# Altium schematic sheet ESP8266.SchDoc
size B; SheetNumber: 1; SheetTotal: 1
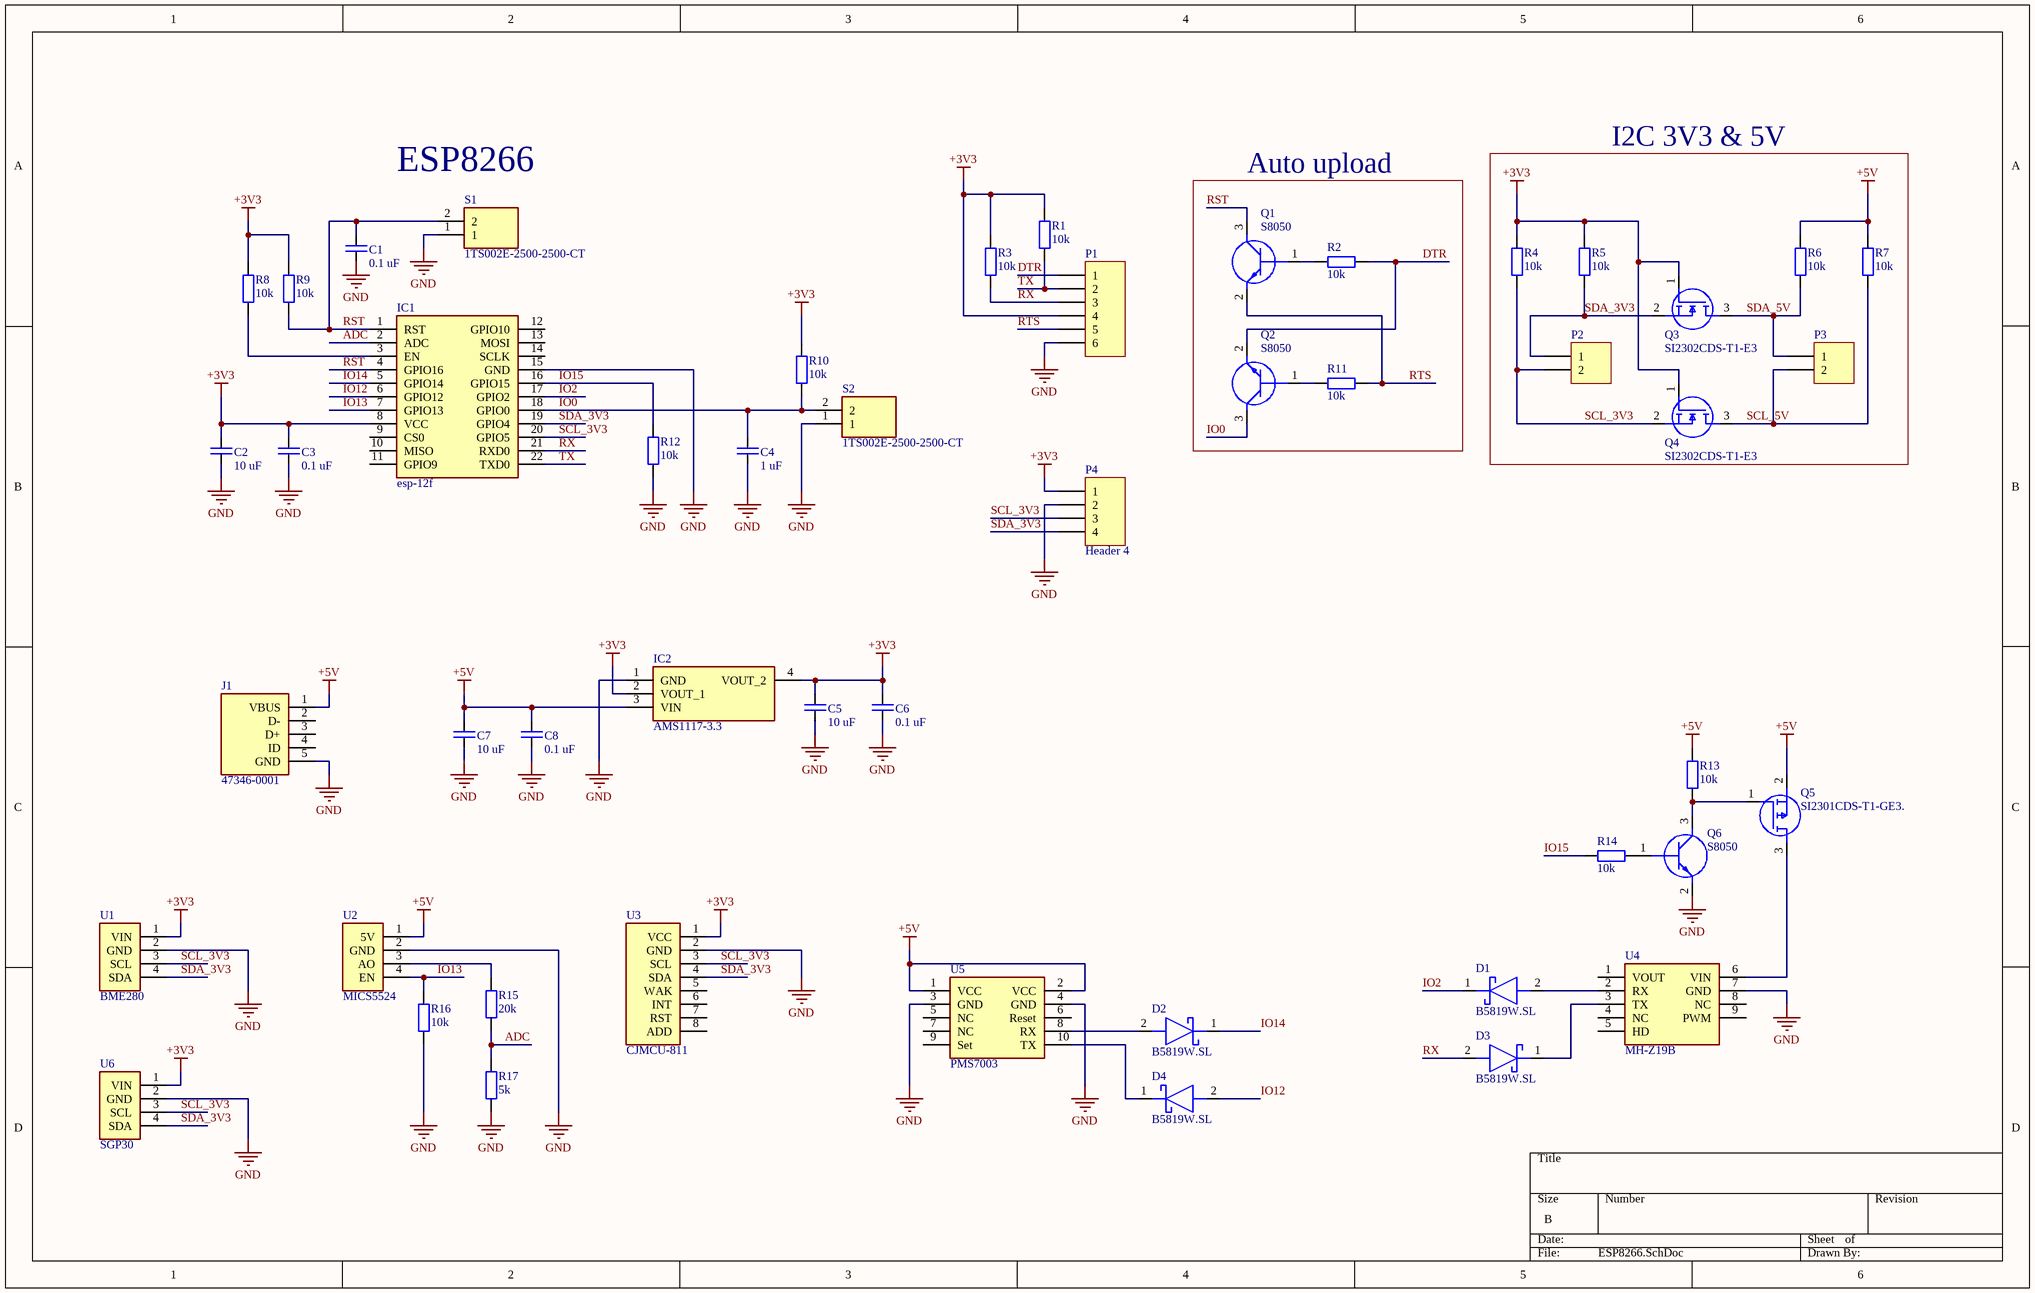
[diagram p0: ESP8266.SchDoc]

## Parts
C1  0.1 uF  [C2012_0805I_N]
C2  10 uF  [C2012_0805I_N]
C3  0.1 uF  [C2012_0805I_N]
C4  1 uF  [C2012_0805I_N]
C5  10 uF  [C2012_0805I_N]
C6  0.1 uF  [C2012_0805I_N]
C7  10 uF  [C2012_0805I_N]
C8  0.1 uF  [C2012_0805I_N]
D1  B5819W.SL  [B5819WSL]
D2  B5819W.SL  [B5819WSL]
D3  B5819W.SL  [B5819WSL]
D4  B5819W.SL  [B5819WSL]
IC1  esp-12f  [esp12f]
IC2  AMS1117-3.3  [SOT229P700X180-4N]
J1  47346-0001  [47346-0001]
P1  (no value)  [HDR1X6]
P2  (no value)  [HDR1X2]
P3  (no value)  [HDR1X2]
P4  Header 4  [HDR1X4]
Q1  S8050  [SOT95P240X110-3N]
Q2  S8050  [SOT95P240X110-3N]
Q3  SI2302CDS-T1-E3  [SOT95P237X112-3N]
Q4  SI2302CDS-T1-E3  [SOT95P237X112-3N]
Q5  SI2301CDS-T1-GE3.  [SOT95P237X112-3N]
Q6  S8050  [SOT95P240X110-3N]
R1  10k  [R2012_0805I_N]
R2  10k  [R2012_0805I_N]
R3  10k  [R2012_0805I_N]
R4  10k  [R2012_0805I_N]
R5  10k  [R2012_0805I_N]
R6  10k  [R2012_0805I_N]
R7  10k  [R2012_0805I_N]
R8  10k  [R2012_0805I_N]
R9  10k  [R2012_0805I_N]
R10  10k  [R2012_0805I_N]
R11  10k  [R2012_0805I_N]
R12  10k  [R2012_0805I_N]
R13  10k  [R2012_0805I_N]
R14  10k  [R2012_0805I_N]
R15  20k  [R2012_0805I_N]
R16  10k  [R2012_0805I_N]
R17  5k  [R2012_0805I_N]
S1  1TS002E-2500-2500-CT  [1TS002E25002500CT]
S2  1TS002E-2500-2500-CT  [1TS002E25002500CT]
U1  BME280  [BME280]
U2  MICS5524  [MICS5524]
U3  CJMCU-811  [CJMCU-811]
U4  MH-Z19B  [MH-Z19B]
U5  PMS7003  [PMS7003]
U6  SGP30  [SGP30]

## Blocks framed on the sheet
I2C 3V3 & 5V: P2 P3 Q3 Q4 R4-R7
Auto upload: Q1 Q2 R2 R11

## Nets
+3V3: C2.1 C3.1 C5.1 C6.1 IC1.8(VCC) IC2.2(VOUT_1) IC2.4(VOUT_2) P1.4 P4.1 Q3.1(G) Q4.1(G) R1.2 R3.2 R4.2 R5.2 R8.2 R9.2 R10.2 U1.1(VIN) U3.1(VCC) U6.1(VIN)
+5V: C7.1 C8.1 IC2.3(VIN) J1.1(VBUS) Q5.2(S) R6.2 R7.2 R13.2 U2.1(5V) U5.1(VCC) U5.2(VCC)
GND: C1.2 C2.2 C3.2 C4.2 C5.2 C6.2 C7.2 C8.2 IC1.15(GND) IC2.1(GND) J1.5(GND) P1.6 P4.2 Q6.2(E) R12.1 R16.1 R17.1 S1.1 S2.1 U1.2(GND) U2.2(GND) U3.2(GND) U4.7(GND) U5.3(GND) U5.4(GND) U6.2(GND)
ADC: IC1.2(ADC) R15.1 R17.2
DTR: P1.1 Q2.2(E) R2.1
IO0: C4.1 IC1.18(GPIO0) Q2.3(C) R10.1 S2.2
IO2: D1.1(K) IC1.17(GPIO2)
IO12: D4.2(A) IC1.6(GPIO12)
IO13: IC1.7(GPIO13) R16.2 U2.4(EN)
IO14: D2.1(K) IC1.5(GPIO14)
IO15: IC1.16(GPIO15) R12.2 R14.2
RST: C1.1 IC1.1(RST) IC1.4(GPIO16) Q1.3(C) R9.1 S1.2
RTS: P1.5 Q1.2(E) R11.1
RX: D3.2(A) IC1.21(RXD0) P1.3 R3.1
SCL_3V3: IC1.20(GPIO5) P2.2 P4.3 Q4.2(S) R4.1 U1.3(SCL) U3.3(SCL) U6.3(SCL)
SCL_5V: P3.2 Q4.3(D) R7.1
SDA_3V3: IC1.19(GPIO4) P2.1 P4.4 Q3.2(S) R5.1 U1.4(SDA) U3.4(SDA) U6.4(SDA)
SDA_5V: P3.1 Q3.3(D) R6.1
TX: IC1.22(TXD0) P1.2 R1.1
NetD1_2: D1.2(A) U4.2(RX)
NetD2_2: D2.2(A) U5.8(RX)
NetD3_1: D3.1(K) U4.3(TX)
NetD4_1: D4.1(K) U5.10(TX)
NetIC1_3: IC1.3(EN) R8.1
NetQ1_1: Q1.1(B) R2.2
NetQ2_1: Q2.1(B) R11.2
NetQ5_1: Q5.1(G) Q6.3(C) R13.1
NetQ5_3: Q5.3(D) U4.6(VIN)
NetQ6_1: Q6.1(B) R14.1
NetR15_2: R15.2 U2.3(AO)

Not connected (* = marked no-connect by the designer): IC1 9(CS0) 10(MISO) 11(GPIO9) 12(GPIO10) 13(MOSI) 14(SCLK); J1 2(D-) 3(D+) 4(ID); U3 5(WAK) 6(INT) 7(RST) 8(ADD); U4 1(VOUT) 4(NC) 5(HD) 8(NC) 9(PWM); U5 5(NC) 6(Reset) 7(NC) 9(Set)

## Notes on the sheet
- (near S1) ESP8266

## Library data of the parts
C1-C8 = C: Capacitor
  C1 C3 C6 C8: Value: 0.1 uF
  C2 C5 C7: Value: 10 uF
  C4: Value: 1 uF
D1-D4 = B5819W.SL: Schottky Diode; Manufacturer_Name: 1-Avel; Datasheet Link: https://file.elecfans.com/web1/M00/8A/32/pIYBAFyLiveAInCMAAthN3CVBXo401.pdf?filename=1505718310707869662.pdf; Height: 1.25mm; Manufacturer_Part_Number: B5819W.SL
IC1 = esp-12f: Integrated Circuit; Manufacturer_Name: Ai-Thinker; Datasheet Link: https://docs.ai-thinker.com/_media/esp8266/docs/esp-12f_product_specification_en.pdf; Height: 3.1mm; Manufacturer_Part_Number: esp-12f
IC2 = AMS1117-3.3: Integrated Circuit; Manufacturer_Name: Advanced Monolithic Systems; Datasheet Link: http://www.advanced-monolithic.com/pdf/ds1117.pdf; Height: 1.8mm; Manufacturer_Part_Number: AMS1117-3.3
J1 = 47346-0001: Connector; Manufacturer_Name: Molex; Datasheet Link: http://www.molex.com/pdm_docs/sd/473460001_sd.pdf; Manufacturer_Part_Number: 47346-0001; Mouser Part Number: 538-47346-0001; Mouser Price/Stock: https://www.mouser.co.uk/ProductDetail/Molex/47346-0001?qs=c2CV6XM0DweJBWaSeyWeCw%3D%3D
P1 = Header 6: Header, 6-Pin; LatestRevisionDate: 17-Jul-2002; LatestRevisionNote: Re-released for DXP Platform.; Publisher: Altium Limited
P2 P3 = Header 2: Header, 2-Pin; LatestRevisionDate: 17-Jul-2002; LatestRevisionNote: Re-released for DXP Platform.; Publisher: Altium Limited
P4 = Header 4: Header, 4-Pin; LatestRevisionDate: 17-Jul-2002; LatestRevisionNote: Re-released for DXP Platform.; Publisher: Altium Limited
Q1 Q2 Q6 = S8050: Transistor BJT NPN; Manufacturer_Name: Galaxy; Manufacturer_Part_Number: S8050G; Height: 1.1mm
Q3 Q4 = SI2302CDS-T1-E3: MOSFET (N-Channel); Manufacturer_Name: Vishay; Datasheet Link: https://labcenter.componentsearchengine.com/Datasheets/2/SI2302CDS-T1-E3.pdf; Height: 1.12mm; Manufacturer_Part_Number: SI2302CDS-T1-E3; Mouser Part Number: 781-SI2302CDS-E3; Mouser Price/Stock: https://www.mouser.co.uk/ProductDetail/Vishay-Semiconductors/SI2302CDS-T1-E3?qs=%252BPu8jn5UVnHNrjAmGCs%2Fuw%3D%3D; Arrow Part Number: SI2302CDS-T1-E3; Arrow Price/Stock: https://www.arrow.com/en/products/si2302cds-t1-e3/vishay
Q5 = SI2301CDS-T1-GE3.: MOSFET (P-Channel); Manufacturer_Name: Vishay; Datasheet Link: https://www.vishay.com/doc?68741; Height: 1.12mm; Manufacturer_Part_Number: SI2301CDS-T1-GE3.
R1-R17 = R
  R1-R14 R16: Value: 10k
  R15: Value: 20k
  R17: Value: 5k
S1 S2 = 1TS002E-2500-2500-CT: Switch; Manufacturer_Name: HON YUAN; Datasheet Link: https://datasheet.lcsc.com/szlcsc/HYP-1TS002E-2500-2500_C329185.pdf; Height: 2.7mm; Manufacturer_Part_Number: 1TS002E-2500-2500-CT